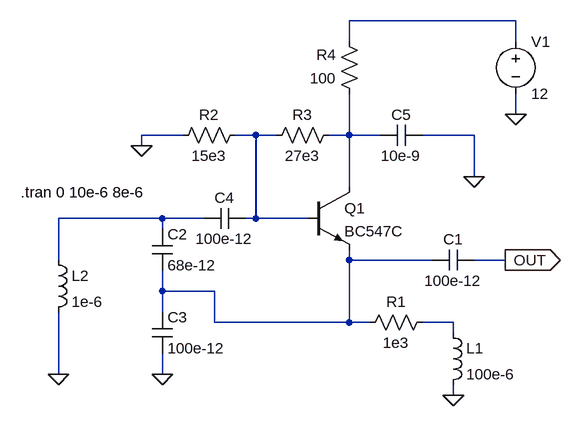
[diagram p0: schematic Draft1.asc]
Draft1.asc, the LTspice schematic file:
Version 4
SHEET 1 880 680
WIRE 464 -192 208 -192
WIRE 208 -160 208 -192
WIRE 464 -160 464 -192
WIRE 464 -48 464 -80
WIRE -48 -16 -112 -16
WIRE 64 -16 32 -16
WIRE 96 -16 64 -16
WIRE 208 -16 208 -80
WIRE 208 -16 176 -16
WIRE 256 -16 208 -16
WIRE 400 -16 320 -16
WIRE -112 0 -112 -16
WIRE 400 48 400 -16
WIRE 208 64 208 -16
WIRE -80 112 -240 112
WIRE -16 112 -80 112
WIRE 64 112 64 -16
WIRE 64 112 48 112
WIRE 144 112 64 112
WIRE -80 128 -80 112
WIRE -240 176 -240 112
WIRE 208 176 208 160
WIRE 336 176 208 176
WIRE 448 176 400 176
WIRE -80 224 -80 192
WIRE 0 224 -80 224
WIRE -80 256 -80 224
WIRE 0 272 0 224
WIRE 208 272 208 176
WIRE 208 272 0 272
WIRE 240 272 208 272
WIRE 368 272 320 272
WIRE 368 288 368 272
WIRE -240 352 -240 256
WIRE -80 352 -80 320
WIRE 368 384 368 368
FLAG 448 176 OUT
IOPIN 448 176 Out
FLAG 368 384 0
FLAG 464 -48 0
FLAG -112 0 0
FLAG 400 48 0
FLAG -80 352 0
FLAG -240 352 0
SYMBOL npn 144 64 R0
SYMATTR InstName Q1
SYMATTR Value BC547C
SYMBOL voltage 464 -176 R0
WINDOW 123 0 0 Left 0
WINDOW 39 0 0 Left 0
SYMATTR InstName V1
SYMATTR Value 12
SYMBOL cap 400 160 R90
WINDOW 0 0 32 VBottom 2
WINDOW 3 32 32 VTop 2
SYMATTR InstName C1
SYMATTR Value 100e-12
SYMBOL res 336 256 R90
WINDOW 0 0 56 VBottom 2
WINDOW 3 32 56 VTop 2
SYMATTR InstName R1
SYMATTR Value 1e3
SYMBOL ind 352 272 R0
SYMATTR InstName L1
SYMATTR Value 100e-6
SYMBOL cap -96 128 R0
SYMATTR InstName C2
SYMATTR Value 68e-12
SYMBOL cap -96 256 R0
SYMATTR InstName C3
SYMATTR Value 100e-12
SYMBOL ind -256 160 R0
SYMATTR InstName L2
SYMATTR Value 1e-6
SYMBOL res 48 -32 R90
WINDOW 0 0 56 VBottom 2
WINDOW 3 32 56 VTop 2
SYMATTR InstName R2
SYMATTR Value 15e3
SYMBOL res 192 -32 R90
WINDOW 0 0 56 VBottom 2
WINDOW 3 32 56 VTop 2
SYMATTR InstName R3
SYMATTR Value 27e3
SYMBOL res 224 -64 R180
WINDOW 0 36 76 Left 2
WINDOW 3 36 40 Left 2
SYMATTR InstName R4
SYMATTR Value 100
SYMBOL cap 48 96 R90
WINDOW 0 0 32 VBottom 2
WINDOW 3 32 32 VTop 2
SYMATTR InstName C4
SYMATTR Value 100e-12
SYMBOL cap 320 -32 R90
WINDOW 0 0 32 VBottom 2
WINDOW 3 32 32 VTop 2
SYMATTR InstName C5
SYMATTR Value 10e-9
TEXT -298 72 Left 2 !.tran 0 10e-6 8e-6

The netlist it stands for:
* Draft1.asc
Q1 N003 N002 N005 0 BC547C
V1 N001 0 12
C1 OUT N005 100e-12
R1 N006 N005 1e3
L1 N006 0 100e-6
C2 N004 N005 68e-12
C3 N005 0 100e-12
L2 N004 0 1e-6
R2 N002 0 15e3
R3 N003 N002 27e3
R4 N003 N001 100
C4 N002 N004 100e-12
C5 0 N003 10e-9
.model NPN NPN
.model PNP PNP
.lib standard.bjt
.tran 0 10e-6 8e-6
.backanno
.end